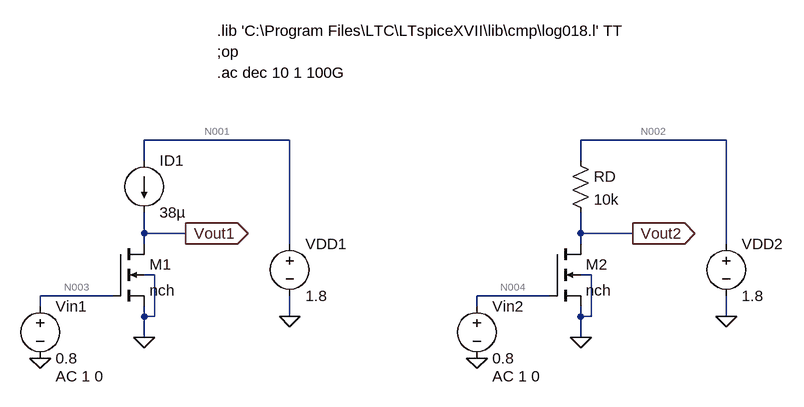
[diagram p0: schematic Exc1.asc]
Exc1.asc, the LTspice schematic file:
Version 4
SHEET 1 1212 680
WIRE 448 -16 224 -16
WIRE 1120 -16 896 -16
WIRE 224 16 224 -16
WIRE 896 16 896 -16
WIRE 224 128 224 96
WIRE 288 128 224 128
WIRE 896 128 896 96
WIRE 976 128 896 128
WIRE 224 144 224 128
WIRE 448 144 448 -16
WIRE 896 144 896 128
WIRE 1120 144 1120 -16
WIRE 240 192 224 192
WIRE 912 192 896 192
WIRE 176 224 64 224
WIRE 848 224 736 224
WIRE 64 240 64 224
WIRE 736 240 736 224
WIRE 224 256 224 240
WIRE 240 256 240 192
WIRE 240 256 224 256
WIRE 448 256 448 224
WIRE 896 256 896 240
WIRE 912 256 912 192
WIRE 912 256 896 256
WIRE 1120 256 1120 224
WIRE 224 288 224 256
WIRE 896 288 896 256
FLAG 224 288 0
FLAG 64 320 0
FLAG 288 128 Vout1
IOPIN 288 128 Out
FLAG 448 256 0
FLAG 896 288 0
FLAG 736 320 0
FLAG 1120 256 0
FLAG 976 128 Vout2
IOPIN 976 128 Out
SYMBOL nmos4 176 144 R0
SYMATTR InstName M1
SYMATTR Value nch
SYMATTR Value2 l=1u w=1u m=2
SYMBOL current 224 16 R0
WINDOW 123 0 0 Left 0
WINDOW 39 0 0 Left 0
SYMATTR InstName ID1
SYMATTR Value 38µ
SYMBOL voltage 64 224 R0
WINDOW 123 24 124 Left 2
WINDOW 39 0 0 Left 0
SYMATTR Value2 AC 1 0
SYMATTR InstName Vin1
SYMATTR Value 0.8
SYMBOL voltage 448 128 R0
WINDOW 123 0 0 Left 0
WINDOW 39 0 0 Left 0
SYMATTR InstName VDD1
SYMATTR Value 1.8
SYMBOL nmos4 848 144 R0
SYMATTR InstName M2
SYMATTR Value nch
SYMATTR Value2 l=1u w=1u m=2
SYMBOL voltage 736 224 R0
WINDOW 123 24 124 Left 2
WINDOW 39 0 0 Left 0
SYMATTR Value2 AC 1 0
SYMATTR InstName Vin2
SYMATTR Value 0.8
SYMBOL voltage 1120 128 R0
WINDOW 123 0 0 Left 0
WINDOW 39 0 0 Left 0
SYMATTR InstName VDD2
SYMATTR Value 1.8
SYMBOL res 880 0 R0
SYMATTR InstName RD
SYMATTR Value 10k
TEXT 336 -152 Left 2 !;op
TEXT 336 -184 Left 2 !.lib 'C:\\Program Files\\LTC\\LTspiceXVII\\lib\\cmp\\log018.l' TT
TEXT 336 -120 Left 2 !.ac dec 10 1 100G

The netlist it stands for:
* Exc1.asc
M1 Vout1 N003 0 0 nch l=1u w=1u m=2
ID1 N001 Vout1 38µ
Vin1 N003 0 0.8 AC 1 0
VDD1 N001 0 1.8
M2 Vout2 N004 0 0 nch l=1u w=1u m=2
Vin2 N004 0 0.8 AC 1 0
VDD2 N002 0 1.8
RD N002 Vout2 10k
.model NMOS NMOS
.model PMOS PMOS
.lib standard.mos
;op
.lib 'C:\Program Files\LTC\LTspiceXVII\lib\cmp\log018.l' TT
.ac dec 10 1 100G
.backanno
.end

* Results of the author's LTspice run, read from the files saved beside the schematic
* Operating Point, zero values left out:
*   V(vout1) = 1.461 V
*   V(n003) = 800 mV
*   V(n001) = 1.8 V
*   V(vout2) = 1.42 V
*   V(n004) = 800 mV
*   V(n002) = 1.8 V
*   Id(M2) = 37.97 µA
*   Ib(M2) = -491.4 pA
*   Is(M2) = -37.97 µA
*   Id(M1) = 38 µA
*   Ib(M1) = -740 pA
*   Is(M1) = -38 µA
*   I(Id1) = 38 µA
*   I(Rd) = 37.97 µA
*   I(Vdd2) = -37.97 µA
*   I(Vdd1) = -38 µA
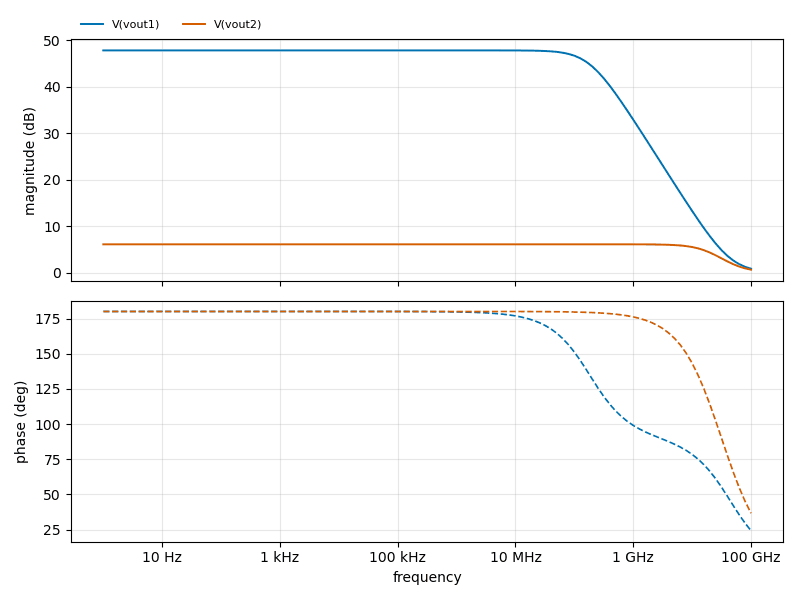
[diagram p1: AC Analysis of Exc1.asc, plotted from the saved traces]
* AC Analysis, 1 run:
*   V(vout1): 47.83 dB at 1 Hz, 0.83 dB at 100 GHz, peak 47.83 dB at 1 Hz, 3 dB below the peak at 181.2 MHz
*   V(vout2): 6.08 dB at 1 Hz, 0.62 dB at 100 GHz, peak 6.08 dB at 1 Hz, 3 dB below the peak at 31.44 GHz